# EAGLE design smartmeterif_2 (EAGLE 9.6.2)
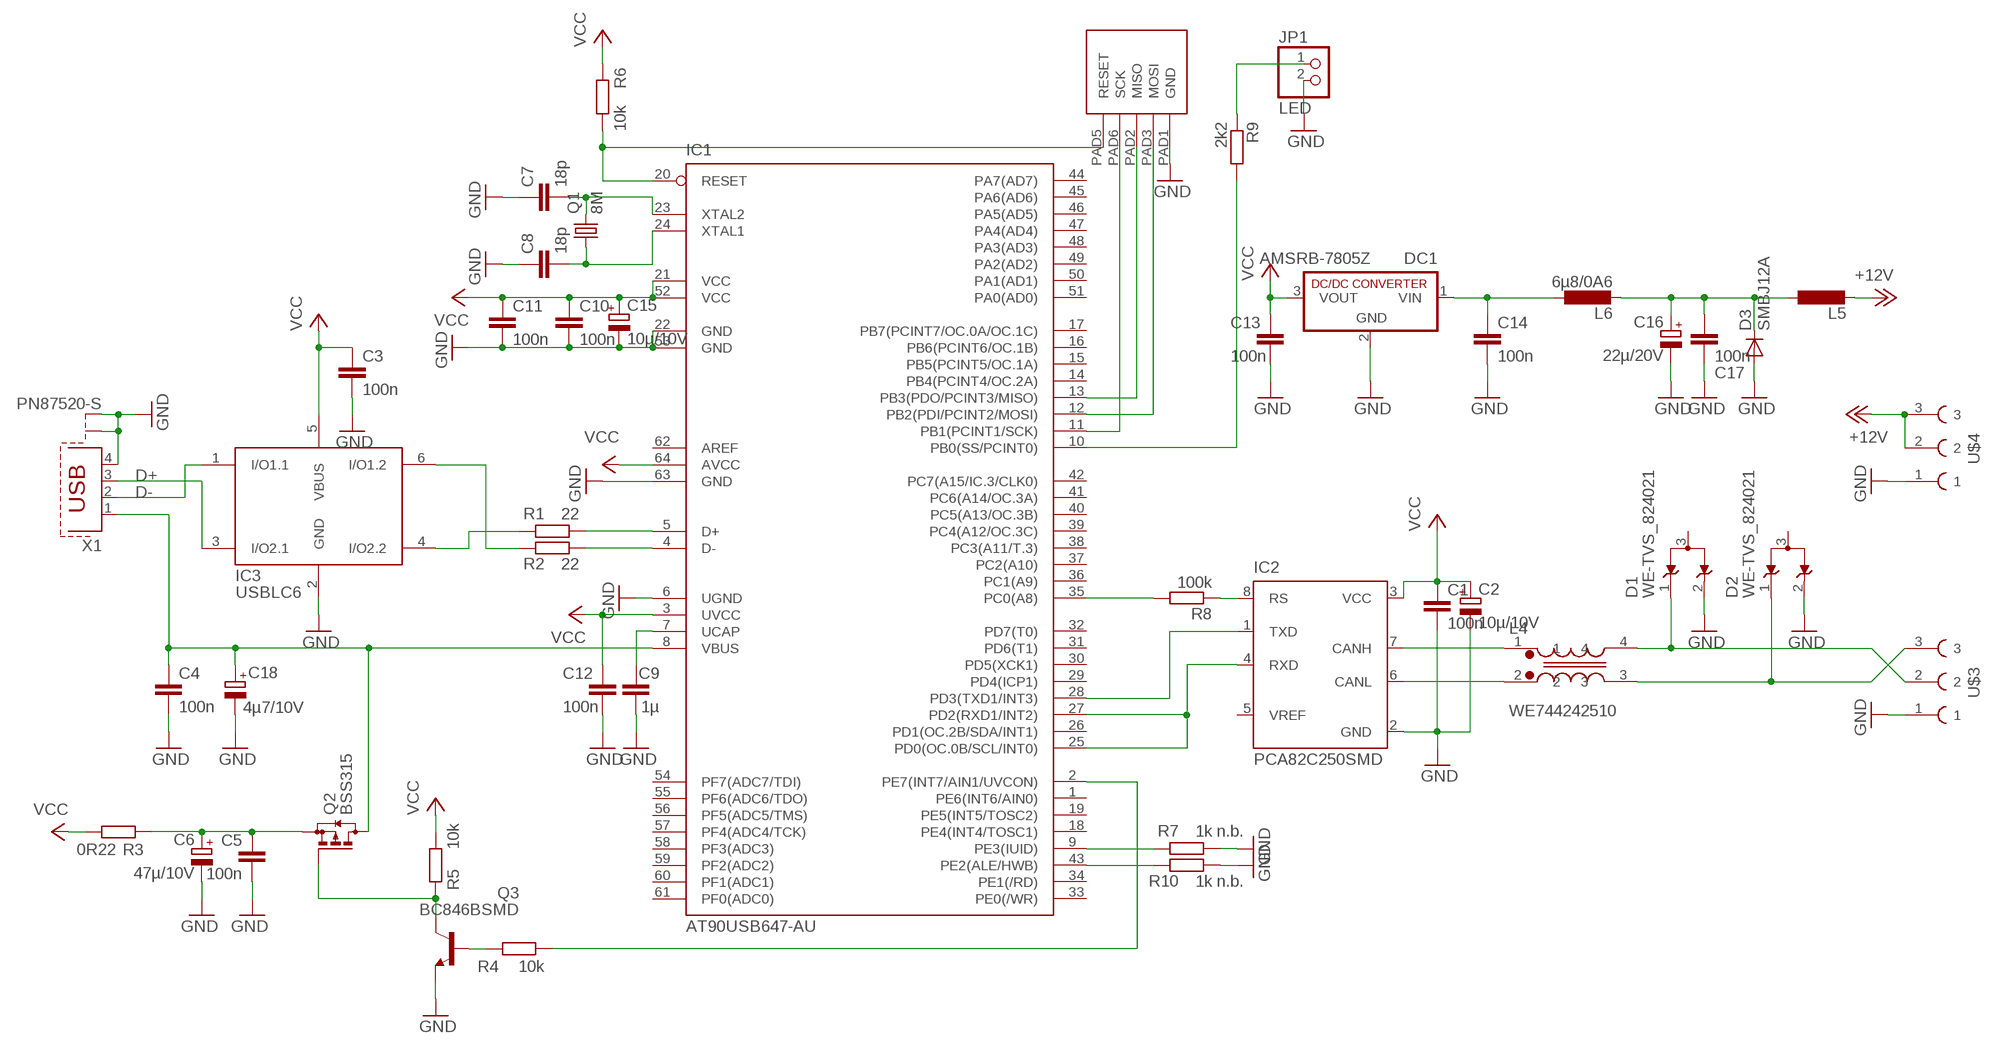
[diagram p0: schematic, sheet 1]

## Parts
C1  100n  C-EUC0603  [C0603]
C2  10µ/10V  CPOL-EUA/3216-18W  [A/3216-18W]
C3  100n  C-EUC0603  [C0603]
C4  100n  C-EUC0603  [C0603]
C5  100n  C-EUC0603  [C0603]
C6  47µ/10V  CPOL-EUSMCC  [SMC_C]
C7  18p  C-EUC0603  [C0603]
C8  18p  C-EUC0603  [C0603]
C9  1µ  C-EUC1210K  [C1210K]
C10  100n  C-EUC0603  [C0603]
C11  100n  C-EUC0603  [C0603]
C12  100n  C-EUC0603  [C0603]
C13  100n  C-EUC0603  [C0603]
C14  100n  C-EUC0603  [C0603]
C15  10µ/10V  CPOL-EUA/3216-18W  [A/3216-18W]
C16  22µ/20V  CPOL-EUSMCC  [SMC_C]
C17  100n  C-EUC0603  [C0603]
C18  4µ7/10V  CPOL-EUSMCA  [SMC_A]
D1  WE-TVS_824021  [WE-TVS_SOT23-3L]
D2  WE-TVS_824021  [WE-TVS_SOT23-3L]
D3  SMBJ12A  DIODE-SMB  [SMB]
DC1  AMSRB-7805Z  R-78C5.0-1.0  [SIP3]
IC1  AT90USB647-AU  [TQFP64]
IC2  PCA82C250SMD  [SO8]
IC3  USBLC6  [SOT23-6L]
JP1  LED  PINHD-1X2  [1X02]
L4  WE744242510  WE-SLM  [WE-SLM]
L5  L-EUL1806  [L1806]
L6  6µ8/0A6  L-EUL1812  [L1812]
Q1  8M  CRYSTALSM49  [SM49]
Q2  BSS315  BSS84  [SOT23]
Q3  BC846BSMD  [SOT23]
R1  22  R-EU_R0603  [R0603]
R2  22  R-EU_R0603  [R0603]
R3  0R22  R-EU_R0603  [R0603]
R4  10k  R-EU_R0603  [R0603]
R5  10k  R-EU_R0603  [R0603]
R6  10k  R-EU_R0603  [R0603]
R7  1k n.b.  R-EU_R0603  [R0603]
R8  100k  R-EU_R0603  [R0603]
R9  2k2  R-EU_R0603  [R0603]
R10  1k n.b.  R-EU_R0603  [R0603]
U$2  ATMEL_ISP  [ATMEL_ISP]
U$3  MKDSO_2.5/3_L  [PHOENIX_MKDSO_2.5/3_L]
U$4  MKDSO_2.5/3_L  [PHOENIX_MKDSO_2.5/3_L]
X1  PN87520-S  [PN87520-S]

## Nets
+12V: L5.2 U$4.2 U$4.3
.D+: IC3.4(I/O2.2) R1.1
.D-: IC3.6(I/O1.2) R2.1
B+: D1.1 L4.4 U$3.2
B-: D2.1 L4.3 U$3.3
D+: IC3.3(I/O2.1) X1.3
D-: IC3.1(I/O1.1) X1.2
GND: C1.2 C2.- C3.2 C4.2 C5.2 C6.- C7.1 C8.1 C9.1 C10.2 C11.2 C12.2 C13.2 C14.2 C15.- C16.- C17.2 C18.- D1.2 D2.2 D3.A DC1.2(GND) IC1.6(UGND) IC1.22(GND) IC1.53(GND) IC1.63(GND) IC2.2(GND) IC3.2(GND) JP1.2 Q3.2(E) R7.2 R10.2 U$2.PAD1(GND) U$3.1 U$4.1 X1.4 X1.S1 X1.S2
N$1: IC1.5(D+) R1.2
N$2: IC1.4(D-) R2.2
N$7: C4.1 C18.+ IC1.8(VBUS) Q2.3(D) X1.1
N$8: C5.1 C6.+ Q2.2(S) R3.1
N$9: IC1.2(PE7(INT7/AIN1/UVCON)) R4.2
N$10: IC2.7(CANH) L4.1
N$11: Q2.1(G) Q3.3(C) R5.1
N$12: Q3.1(B) R4.1
N$13: IC1.10(PB0(SS/PCINT0)) R9.2
N$14: JP1.1 R9.1
N$15: IC1.35(PC0(A8)) R8.2
N$16: IC1.28(PD3(TXD1/INT3)) IC2.1(TXD)
N$17: IC2.6(CANL) L4.2
N$18: IC1.25(PD0(OC.0B/SCL/INT0)) IC1.27(PD2(RXD1/INT2)) IC2.4(RXD)
N$19: IC1.43(PE2(ALE/HWB)) R10.1
N$20: IC1.20(RESET) R6.2 U$2.PAD5(RESET)
N$21: IC1.11(PB1(PCINT1/SCK)) U$2.PAD6(SCK)
N$22: IC1.12(PB2(PDI/PCINT2/MOSI)) U$2.PAD3(MOSI)
N$23: IC1.13(PB3(PDO/PCINT3/MISO)) U$2.PAD2(MISO)
N$24: C7.2 IC1.23(XTAL2) Q1.2
N$25: C8.2 IC1.24(XTAL1) Q1.1
N$26: C9.2 IC1.7(UCAP)
N$27: IC2.8(RS) R8.1
N$28: C16.+ C17.1 D3.C L5.1 L6.2
N$29: C14.1 DC1.1(VIN) L6.1
N$30: IC1.9(PE3(IUID)) R7.1
VCC: C1.1 C2.+ C3.1 C10.1 C11.1 C12.1 C13.1 C15.+ DC1.3(VOUT) IC1.3(UVCC) IC1.21(VCC) IC1.52(VCC) IC1.64(AVCC) IC2.3(VCC) IC3.5(VBUS) R3.2 R5.2 R6.1
Unconnected: D1.3(GND) D2.3(GND) IC1.1(PE6(INT6/AIN0)) IC1.14(PB4(PCINT4/OC.2A)) IC1.15(PB5(PCINT5/OC.1A)) IC1.16(PB6(PCINT6/OC.1B)) IC1.17(PB7(PCINT7/OC.0A/OC.1C)) IC1.18(PE4(INT4/TOSC1)) IC1.19(PE5(INT5/TOSC2)) IC1.26(PD1(OC.2B/SDA/INT1)) IC1.29(PD4(ICP1)) IC1.30(PD5(XCK1)) IC1.31(PD6(T1)) IC1.32(PD7(T0)) IC1.33(PE0(/WR)) IC1.34(PE1(/RD)) IC1.36(PC1(A9)) IC1.37(PC2(A10)) IC1.38(PC3(A11/T.3)) IC1.39(PC4(A12/OC.3C)) IC1.40(PC5(A13/OC.3B)) IC1.41(PC6(A14/OC.3A)) IC1.42(PC7(A15/IC.3/CLK0)) IC1.44(PA7(AD7)) IC1.45(PA6(AD6)) IC1.46(PA5(AD5)) IC1.47(PA4(AD4)) IC1.48(PA3(AD3)) IC1.49(PA2(AD2)) IC1.50(PA1(AD1)) IC1.51(PA0(AD0)) IC1.54(PF7(ADC7/TDI)) IC1.55(PF6(ADC6/TDO)) IC1.56(PF5(ADC5/TMS)) IC1.57(PF4(ADC4/TCK)) IC1.58(PF3(ADC3)) IC1.59(PF2(ADC2)) IC1.60(PF1(ADC1)) IC1.61(PF0(ADC0)) IC1.62(AREF) IC2.5(VREF)

## Library data of the parts
C1 C3-C5 C10-C14 C17 = resistor:C-EU: CAPACITOR, European symbol
C2 C6 C15 C16 C18 = rcl:CPOL-EU: POLARIZED CAPACITOR, European symbol
C7-C9 = rcl:C-EU: CAPACITOR, European symbol
D1 D2 = EagleLibrary_Wuerth_Elektronik_eiSos_V6_20140807:WE-TVS_824021: TVS Diode Array WE-TVS, Standard Series - Low capazity - No leakage current - Low clamping voltage - high ESD voltage protection - Uni- and bidirectional protection -- DC Distribution -- Headsets and Accessoires -- PDAs -- Digital Cameras -- MP3-Players -- Touch Panels <http://katalog.we-online.de/media/images/eisos/VarTVS_highspeed_pf2.jpg.jpg> Details see: http://katalog.we-online.de/en/pbs/WE-TVS_High_Speed? Updated by Dan Xu 2014-07-11 2014 (C) Würth Elektronik
D3 = diode:DIODE-: DIODE
DC1 = dc-dc-converter:R-78C*-1.0: INNOLINE DC/DC-Converter 1.0 AMP SIP3 Single Output Source: Data sheet <http://www.mikrocontroller.net/attachment/150645/157764-da-01-en-DC_DC_WANDLER_R_78C5_0_1_0.pdf>
IC1 = at90usb:AT90USB647-*: Atmel AT90USB647 AVR Microcontroller with USB Interface and 64kB Flash Memory
IC2 = mylib:PCA82C250: CAN CONTROLLER INTERFACE
IC3 = mylib:USBLC6
JP1 = pinhead:PINHD-1X2: PIN HEADER
L4 = EagleLibrary_Wuerth_Elektronik_eiSos_V6_20140807:WE-SLM: SMD Common Mode Line Filter WE-SLM - Small size - Low Profile - High Impedance - High current capability up to 300 mA -- USB -- CAN -- Firewire -- Data Lines -- Power supply systems -- Signal Lines <http://katalog.we-online.de/media/images/eisos/IndSLM_pf2.jpg> Details see: http://katalog.we-online.de/en/pbs/WE-SLM?? Updated by Dan Xu 2014-07-11 2014 (C) Würth Elektronik
L5 = mylib:L-EU: INDUCTOR, European symbol
L6 = rcl:L-EU: INDUCTOR, European symbol
Q1 = crystal:CRYSTAL: CRYSTAL; OC_FARNELL: unknown; OC_NEWARK: unknown
Q2 = transistor-small-signal:BSS84: P-CHANNEL MOS FET
Q3 = transistor-npn:BC846*: NPN Transistor
R1-R7 R10 = rcl:R-EU_: RESISTOR, European symbol
R8 R9 = resistor:R-EU_: RESISTOR, European symbol
U$2 = mylib:ATMEL_ISP
U$3 U$4 = mylib:MKDSO_2.5/3_L
X1 = con-berg:PN87520-S; OC_FARNELL: unknown; OC_NEWARK: unknown

## Board
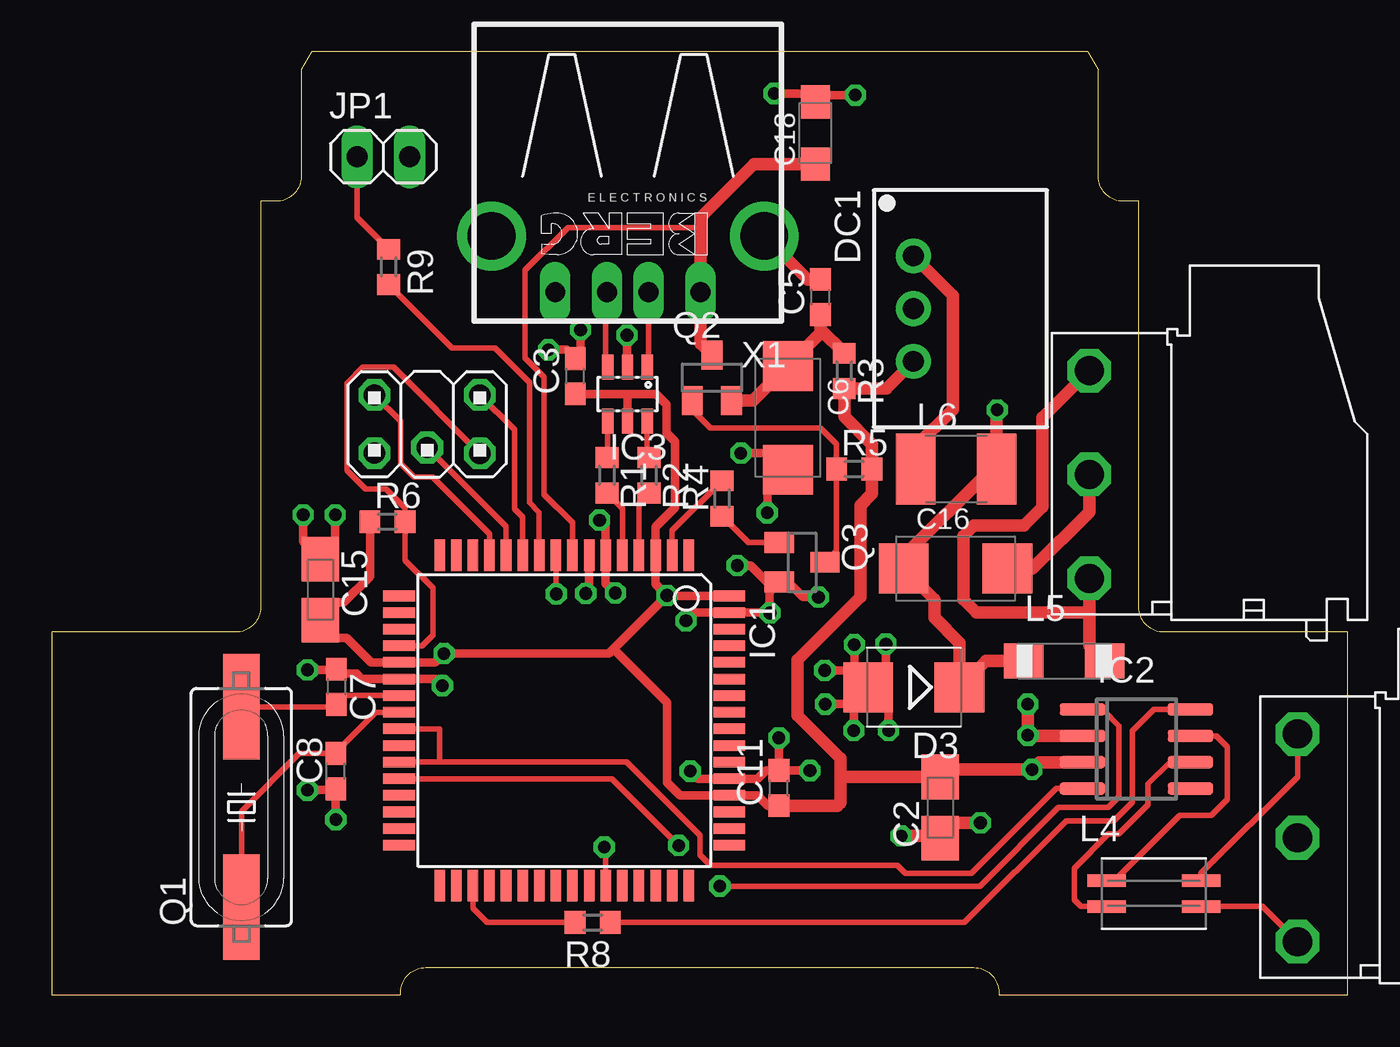
[diagram p1: board, top side]
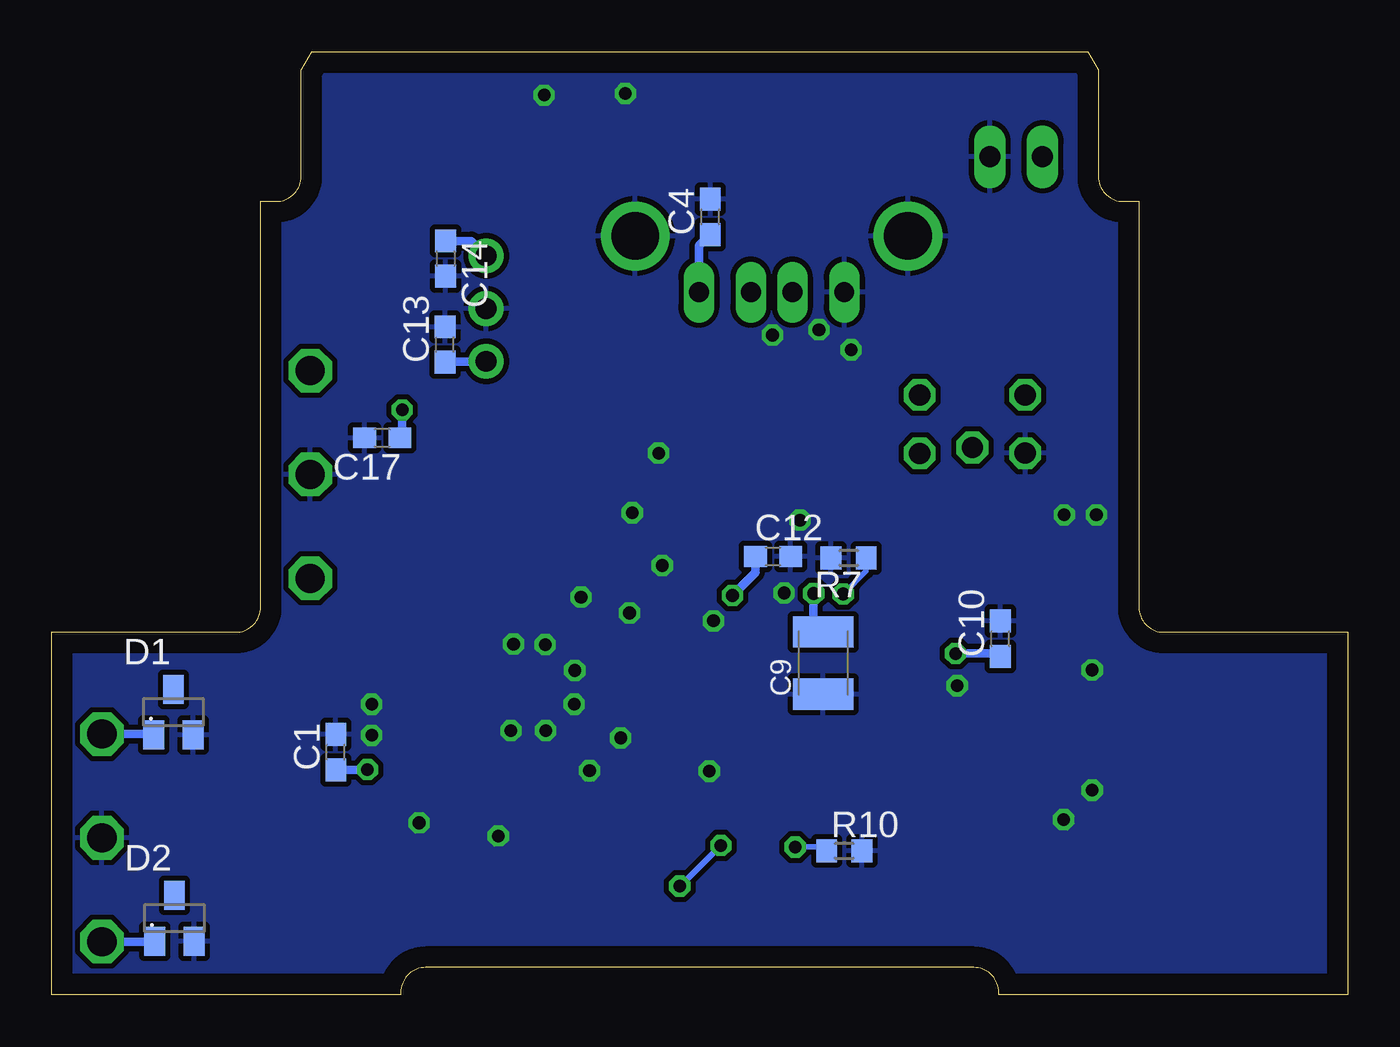
[diagram p2: board, bottom side, seen from below]

Size 62.4 x 45.41 mm. Coordinates in mm from the lower left corner, seen from the top.
Copper layers (1*16): Top 0.035mm / dielectric 1.5mm / Bottom 0.035mm
Design rules "Bilex DRU": minimum track width 10mil, minimum drill 24mil, track to track 10mil, track to pad 10mil, pad to pad 10mil, via to via 10mil, smd to smd 10mil, copper to edge 40mil, drill to drill 8mil, minimum pad ring 10mil, minimum via ring 8mil, stop-mask expansion 4mil, vias tented up to drill 0mil, thermal gap 10mil
vRestrict: 2 lines

### Footprints (pad centres in the part's own frame; a part is rotated, then mirrored left to right if it is on the bottom)
C0603 = smd 1.1 x 1: 1 -0.85,0; 2 0.85,0
A/3216-18W = smd 2.15 x 1.8: + 1.475,0; - -1.475,0
SMC_C = smd 2.4 x 2.4: + -2.5,0; - 2.5,0
C1210K = smd 1.5 x 2.9: 1 -1.5,0; 2 1.5,0
SMC_A = smd 1.6 x 1.4: + -1.5,0; - 1.5,0
WE-TVS_SOT23-3L = smd 1 x 1.4: 1 -0.95,-1.1; 2 0.95,-1.1; 3 0,1.1
SMB = smd 2.4 x 2.4: A 2.2,0; C -2.2,0
SIP3 = drill 1 pad 1.676: 1 -2.54,0; 2 0,0; 3 2.54,0
TQFP64 = smd 1.524 x 0.508: 1 -7.952,6; 2 -7.952,5.2; 3 -7.952,4.4; 4 -7.952,3.6; 5 -7.952,2.8; 6 -7.952,2; 7 -7.952,1.2; 8 -7.952,0.4; 9 -7.952,-0.4; 10 -7.952,-1.2; 11 -7.952,-2; 12 -7.952,-2.8; 13 -7.952,-3.6; 14 -7.952,-4.4; 15 -7.952,-5.2; 16 -7.952,-6; 33 7.952,-6; 34 7.952,-5.2; 35 7.952,-4.4; 36 7.952,-3.6; 37 7.952,-2.8; 38 7.952,-2; 39 7.952,-1.2; 40 7.952,-0.4; 41 7.952,0.4; 42 7.952,1.2; 43 7.952,2; 44 7.952,2.8; 45 7.952,3.6; 46 7.952,4.4; 47 7.952,5.2; 48 7.952,6 | smd 0.508 x 1.524: 17 -6,-7.952; 18 -5.2,-7.952; 19 -4.4,-7.952; 20 -3.6,-7.952; 21 -2.8,-7.952; 22 -2,-7.952; 23 -1.2,-7.952; 24 -0.4,-7.952; 25 0.4,-7.952; 26 1.2,-7.952; 27 2,-7.952; 28 2.8,-7.952; 29 3.6,-7.952; 30 4.4,-7.952; 31 5.2,-7.952; 32 6,-7.952; 49 6,7.952; 50 5.2,7.952; 51 4.4,7.952; 52 3.6,7.952; 53 2.8,7.952; 54 2,7.952; 55 1.2,7.952; 56 0.4,7.952; 57 -0.4,7.952; 58 -1.2,7.952; 59 -2,7.952; 60 -2.8,7.952; 61 -3.6,7.952; 62 -4.4,7.952; 63 -5.2,7.952; 64 -6,7.952
SO8 = smd 0.6 x 2.2: 1 -1.905,-2.6; 2 -0.635,-2.6; 3 0.635,-2.6; 4 1.905,-2.6; 5 1.905,2.6; 6 0.635,2.6; 7 -0.635,2.6; 8 -1.905,2.6
SOT23-6L = smd 0.55 x 1.2: 1 -0.95,-1.3; 2 0,-1.3; 3 0.95,-1.3; 4 0.95,1.3; 5 0,1.3; 6 -0.95,1.3
1X02 = drill 1.016 long: 1 -1.27,0; 2 1.27,0
WE-SLM = smd 1.85 x 0.6: 1 -2.28,0.63; 2 -2.28,-0.62; 3 2.27,-0.62; 4 2.27,0.63
L1806 = smd 1.9 x 1.7: 1 -0.68,0; 2 3.22,0
L1812 = smd 1.9 x 3.4: 1 -1.95,0; 2 1.95,0
SM49 = smd 5.08 x 1.778: 1 -4.826,0; 2 4.826,0
SOT23 = smd 1 x 1.4: 1 -0.95,-1.1; 2 0.95,-1.1; 3 0,1.1
R0603 = smd 1 x 1.1: 1 -0.85,0; 2 0.85,0
ATMEL_ISP = drill 1.016 octagon: PAD1 1.397,-2.54; PAD2 -1.41,-2.54; PAD3 1.13,0; PAD5 1.41,2.54; PAD6 -1.41,2.54
PHOENIX_MKDSO_2.5/3_L = drill 1.4 octagon: 1 -7.1,-0.62; 2 -7.1,4.38; 3 -7.1,-5.62
PN87520-S = drill 0.95 long: 1 -3.5,2.71; 2 -1,2.71; 3 1,2.71; 4 3.5,2.71 | drill 2.3 pad 2.9: S1 -6.57,0; S2 6.57,0

### Placement (x,y rotation side)
C1  48.73,11.68 90 bottom
C2  42.78,9.02 90 top
C3  25.21,29.79 90 top
C4  30.69,37.46 90 bottom
C5  37.02,33.6 90 top
C6  35.44,27.79 270 top
C7  13.7,14.83 270 top
C8  13.67,10.77 90 top
C9  25.26,15.98 90 bottom
C10  16.72,17.14 90 bottom
C11  35.01,9.96 90 top
C12  27.67,21.11 0 bottom
C13  43.47,31.32 90 bottom
C14  43.44,35.46 270 bottom
C15  12.94,19.51 270 top
C16  43.52,20.52 0 top
C17  46.49,26.82 180 bottom
C18  36.76,41.5 90 top
D1  56.55,13.61 0 bottom
D2  56.5,3.68 0 bottom
D3  41.51,14.81 180 top
DC1  41.49,33.05 270 top
IC1  24.67,13.21 270 top
IC2  52.23,11.84 270 top
IC3  27.72,28.93 180 top
JP1  15.96,40.36 0 top
L4  53.07,4.88 0 top
L5  47.48,16.08 0 top
L6  43.54,25.32 0 top
Q1  9.13,9.04 90 top
Q2  31.78,29.72 0 top
Q3  36.13,20.83 270 top
R1  26.73,25.02 270 top
R2  28.76,25.02 270 top
R3  38.16,30.05 270 top
R4  32.27,23.9 90 top
R5  38.64,25.32 0 top
R6  16.16,22.78 0 top
R7  24.04,21.03 180 bottom
R8  26.04,3.48 180 top
R9  16.21,35.05 270 top
R10  24.24,6.93 0 bottom
U$2  18.07,27.48 270 top
U$3  67.09,8.18 0 top
U$4  57.06,25.68 0 top
U$5  [GEHÄUSE_PHOENIX_BC_17.8_REDUCED_REDUCED]  31.2,-5.59 0 top  (outside the outline)
X1  27.74,36.55 180 top

### Tracks (layer width: path | path; a pad name or v marks a point on that pad's centre or on a via)
+12V
  Top 0.61: U$4.2 47.71,27.81 47.71,23.49 46.82,22.61 44.41,22.61 43.9,22.1 43.9,19.05 44.53,18.41 49.96,18.41 | U$4.3 49.96,18.41 | 49.96,18.41 49.96,16.82 L5.2
.D+
  Top 0.254: IC3.4 26.77,25.87 R1.1
.D-
  Top 0.254: IC3.6 28.67,25.87 R2.1
B+
  Top 0.254: L4.4 55.34,5.85 59.99,10.5 U$3.2
  Bottom 0.406: U$3.2 57.5,12.56 D1.1
B-
  Top 0.254: L4.3 58.29,4.26 U$3.3
  Bottom 0.406: U$3.3 57.45,2.56 D2.1
D+
  Top 0.254: X1.3 26.65,33.84 26.65,30.23 IC3.3
D-
  Top 0.254: X1.2 28.74,30.23 IC3.1
GND  (via drill 0.61)
  Top 0.406: v12.3,9.86 13.61,9.86 C8.1 v13.67,8.43 | v38.69,43.33 37.09,43.33 C18.- 36.36,43.41 v34.78,43.41 | v12.3,15.65 13.66,15.65 C7.1 13.91,15.47 14.66,15.47 14.92,15.21 IC1.22 18.48,15.21 v18.8,14.88 | v12.1,23.11 12.1,21.82 C15.- 13.65,21.69 v13.65,23.11 | v30.74,10.77 31.1,10.41 IC1.53 33.99,10.41 34.39,10.81 C11.2 | C11.2 v35.01,12.37 | C11.2 35.02,10.79 v36.51,10.79 | 34.64,26.09 v33.18,26.09 | C6.- 34.45,24.3 v34.45,23.22 | IC3.2 27.69,30.26 v27.69,31.77 | v26.37,22.86 26.67,22.56 IC1.6 26.67,19.82 v27.14,19.36 | v30.54,18.01 30.94,18.41 IC1.63 34.56,18.41 | v25.46,32.03 25.46,30.9 C3.2 24.79,31.06 v23.91,31.06 | v33,20.68 33.64,20.68 34.44,19.88 Q3.2 | Q3.2 35.45,19.88 36.18,19.15 v36.91,19.15 | 34.56,18.41 v34.58,18.39 | Q3.2 34.56,19.41 34.56,18.41 | v40.17,16.89 40.17,15.66 D3.A | v38.64,16.87 38.64,15.48 D3.A | v37.22,15.62 38.5,15.62 D3.A | v37.25,13.99 38.5,13.99 D3.A | v38.62,12.72 38.62,14.11 D3.A | v40.29,12.72 40.29,13.83 D3.A
  Top 0.61: U$4.1 49.96,23.26 47.22,20.52 C16.- | C5.2 36.4,34.45 X1.S1 | v40.9,7.65 42.68,7.65 C2.- 43.52,8.28 v44.71,8.28 | IC2.2 47.02,12.47 v47,12.5 v47,13.99 | C6.- 34.64,26.09
  pour Bottom: -0.04,45.75 62.89,45.88 63.12,-0.5 -0.39,-0.42
N$1
  Top 0.254: R1.2 27.47,23.43 IC1.5
N$2
  Top 0.254: R2.2 28.27,23.68 IC1.4
N$7
  Top 0.254: IC1.8 25.07,22.74 23.71,24.11 23.71,29.74 22.79,30.66 22.79,34.9 24.85,36.96 31.24,36.96
  Top 0.61: C18.+ 33.81,40 31.24,37.43 31.24,36.96 X1.1 31.24,31.36 Q2.3
  Bottom 0.406: X1.1 31.24,36.07 C4.1
N$8
  Top 0.61: Q2.2 33.77,28.62 C6.+ 37.02,31.86 C5.1 37.02,32.04 R3.1
N$9
  Top 0.254: R4.2 29.87,22.36 IC1.2
N$10
  Top 0.254: IC2.7 56.07,12.47 56.6,11.94 56.6,9.4 55.84,8.64 54.31,8.64 51.19,5.51 L4.1
N$11
  Top 0.254: Q2.1 30.83,28.18 31.71,27.3 37,27.3 37.79,26.52 R5.1 37.79,21.39 Q3.3
N$12
  Top 0.254: R4.1 33.54,21.78 Q3.1
N$13
  Top 0.254: R9.2 19.28,31.14 21.34,31.14 23,29.49 23,23.7 23.47,23.22 IC1.10
N$14
  Top 0.254: R9.1 14.69,37.43 JP1.1
N$15
  Top 0.254: R8.2 20.96,3.48 20.27,4.17 IC1.35
N$16  (via drill 0.61)
  Top 0.254: IC1.28 26.96,10.41 v30.18,7.19 | v32.16,5.23 44.69,5.23 48.47,9.02 50.88,9.02 51.39,9.52 51.39,12.95 50.61,13.74 IC2.1
  Bottom 0.254: v30.18,7.19 32.14,5.23 v32.16,5.23
N$17
  Top 0.254: L4.2 49.55,4.26 49.23,4.57 49.23,6.1 50.88,7.75 51.39,7.75 52.79,9.14 52.79,10.16 53.83,11.2 IC2.6
N$18
  Top 0.254: 18.68,11.21 27.66,11.21 31.2,7.67 31.2,6.73 31.71,6.22 40.72,6.22 41.11,5.84 44.28,5.84 48.37,9.93 IC2.4 | 18.68,11.21 IC1.27 | IC1.25 18.68,12.81 18.68,11.21
N$19  (via drill 0.61)
  Top 0.254: IC1.43 26.67,7.04 v26.6,7.11
  Bottom 0.254: R10.1 25.27,7.11 v26.6,7.11
N$20
  Top 0.254: IC1.20 17.83,16.81 18.35,17.32 18.35,19.58 17.01,20.92 R6.2 17.01,23.43 16.09,24.36 15.1,24.36 14.21,25.25 14.21,29.46 14.97,30.23 16.45,30.23 U$2.PAD5
N$21
  Top 0.254: U$2.PAD6 22.29,27.22 22.29,23.39 22.67,23.01 IC1.11
N$22
  Top 0.254: U$2.PAD3 21.87,22.55 IC1.12
N$23
  Top 0.254: U$2.PAD2 16.8,27.62 16.8,25.58 17.43,24.94 18.32,24.94 21.07,22.19 IC1.13
N$24
  Top 0.254: Q1.2 13.58,13.87 C7.2 14.12,14.41 IC1.23
N$25
  Top 0.254: Q1.1 9.13,8.84 11.91,11.62 C8.2 13.67,11.99 13.98,11.99 15.6,13.61 IC1.24
N$26  (via drill 0.61)
  Top 0.406: IC1.7 25.87,19.49 v25.71,19.33
  Bottom 0.406: C9.2 25.71,17.93 v25.71,19.33
N$27
  Top 0.254: R8.1 43.95,3.48 48.85,8.38 51.14,8.38 52.03,9.27 52.03,12.7 53.07,13.74 IC2.8
N$28  (via drill 0.61)
  Top 0.61: L5.1 44.98,16.08 D3.C 43.71,16.95 42.5,18.16 42.5,19.04 C16.+ 41.02,21.1 45.24,25.32 L6.2 45.49,28.14 v45.53,28.17
  Bottom 0.406: v45.53,28.17 45.53,26.94 C17.1
N$29
  Top 0.61: DC1.1 43.39,33.68 43.39,28.19 41.59,26.4 L6.1
  Bottom 0.406: C14.1 42.21,36.31 DC1.1
N$30  (via drill 0.61)
  Top 0.254: IC1.9 24.27,19.32 v24.29,19.3
  Bottom 0.254: R7.1 23.19,20.41 v24.29,19.3
VCC  (via drill 0.61)
  Top 0.406: R6.1 15.31,20.16 14.05,18.9 13.67,18.9 12.94,18.16 C15.+ 12.94,17.73 13.47,17.2 14.18,17.2 15.37,16.01 IC1.21 18.45,16.01 v18.88,16.43 26.83,16.43 27.05,16.65 | 27.05,16.65 v29.62,19.23 | v29.62,19.23 29.07,19.78 IC1.3 29.07,22.54 30.01,23.47 30.01,26.64 29.6,27.05 29.6,28.42 29.09,28.93 27.72,28.93 | IC1.64 29.64,19.21 v29.62,19.23 | 27.05,16.65 29.62,14.07 29.62,10.24 30.25,9.61 IC1.52 33.99,9.61 34.49,9.11 C11.1 | 27.72,28.93 25.22,28.93 C3.1 | IC3.5 27.72,28.93
  Top 0.61: DC1.3 40.18,29.2 R3.2 38.16,27.84 39.49,26.51 R5.2 39.49,24.13 38.93,23.57 38.93,19.16 35.9,16.13 35.9,13.46 37.97,11.39 37.97,10.54 | 37.97,10.54 37.97,9.24 37.83,9.11 C11.1 | 37.97,10.54 38.02,10.49 C2.+ 43.14,10.85 v47.2,10.85 47.56,11.2 IC2.3
  Bottom 0.406: C10.1 16.86,16.16 17.13,16.43 v18.88,16.43 | C12.1 28.52,20.33 v29.62,19.23 | C1.1 v47.21,10.83 v47.2,10.85 | C13.1 43.43,30.51 DC1.3